# Altium schematic sheet Motor.SchDoc
size A3; SheetNumber: 5; SheetTotal: 6
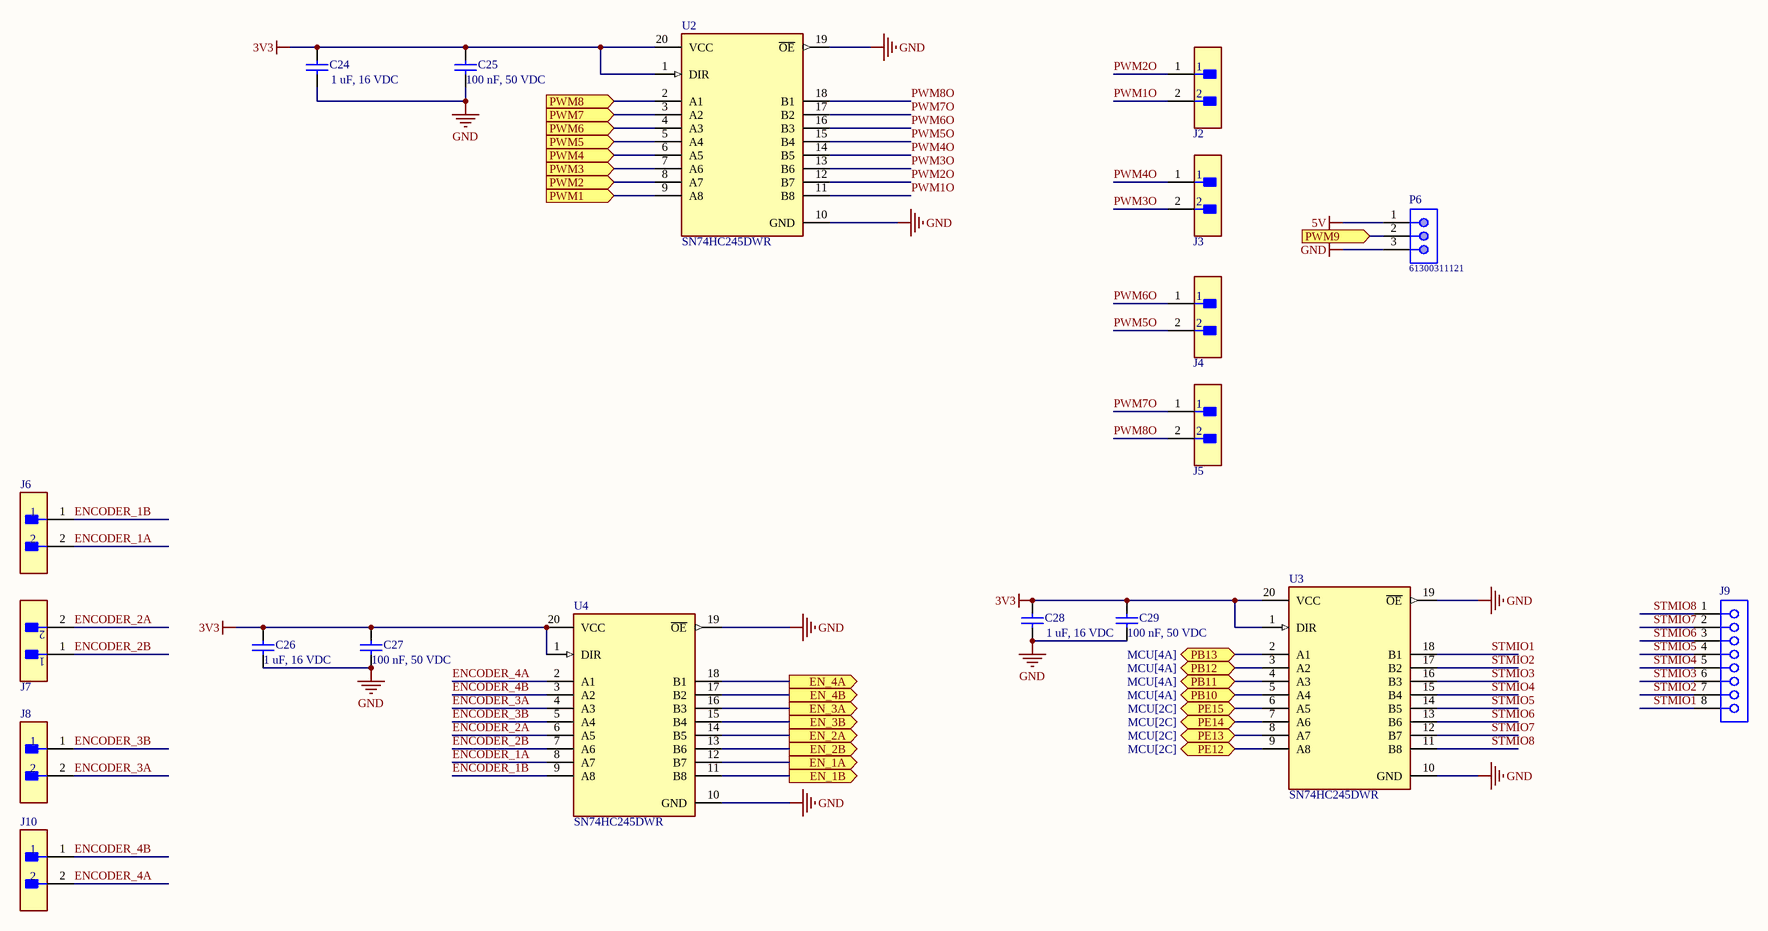
[diagram p0: Motor.SchDoc]

## Parts
C24  1 uF, 16 VDC  [CAP_0603]
C25  100 nF, 50 VDC  [CAP_0603]
C26  1 uF, 16 VDC  [CAP_0603]
C27  100 nF, 50 VDC  [CAP_0603]
C28  1 uF, 16 VDC  [CAP_0603]
C29  100 nF, 50 VDC  [CAP_0603]
J2  B2B-XH-A(LF)(SN)  [FP-B2B-XH-A_LF_SN-MFG]  (value not drawn)
J3  B2B-XH-A(LF)(SN)  [FP-B2B-XH-A_LF_SN-MFG]  (value not drawn)
J4  B2B-XH-A(LF)(SN)  [FP-B2B-XH-A_LF_SN-MFG]  (value not drawn)
J5  B2B-XH-A(LF)(SN)  [FP-B2B-XH-A_LF_SN-MFG]  (value not drawn)
J6  B2B-XH-A(LF)(SN)  [FP-B2B-XH-A_LF_SN-MFG]  (value not drawn)
J7  B2B-XH-A(LF)(SN)  [FP-B2B-XH-A_LF_SN-MFG]  (value not drawn)
J8  B2B-XH-A(LF)(SN)  [FP-B2B-XH-A_LF_SN-MFG]  (value not drawn)
J9  61300811821  [61300811821]  (value not drawn)
J10  B2B-XH-A(LF)(SN)  [FP-B2B-XH-A_LF_SN-MFG]  (value not drawn)
P6  61300311121  [61300311121]
U2  SN74HC245DWR  [FP-DW0020A-IPC_A]
U3  SN74HC245DWR  [FP-DW0020A-IPC_A]
U4  SN74HC245DWR  [FP-DW0020A-IPC_A]

## Ports
EN_1A (out, see MCU[2C]), EN_1B (out, see MCU[2C]), EN_2A (out, see MCU[2A]), EN_2B (out, see MCU[2A]), EN_3A (out, see MCU[2A]), EN_3B (out, see MCU[4A]), EN_4A (out, see MCU[2A]), EN_4B (out, see MCU[2A]), PB10 (bidir, see MCU[4A]), PB11 (bidir, see MCU[4A]), PB12 (bidir, see MCU[4A]), PB13 (bidir, see MCU[4A]), PE12 (bidir, see MCU[2C]), PE13 (bidir, see MCU[2C]), PE14 (bidir, see MCU[2C]), PE15 (bidir, see MCU[2C]), PWM1 (in, see MCU[4B]), PWM2 (in, see MCU[4B]), PWM3 (in, see MCU[4B]), PWM4 (in, see MCU[4B]), PWM5 (in, see MCU[2B]), PWM6 (in, see MCU[2B]), PWM7 (in, see MCU[2B]), PWM8 (in, see MCU[2B]), PWM9 (in, see MCU[4A])

## Nets
3V3: C24.2 C25.2 C26.2 C27.2 C28.2 C29.2 U2.1(DIR) U2.20(VCC) U3.1(DIR) U3.20(VCC) U4.1(DIR) U4.20(VCC)
5V: P6.1
GND: C24.1 C25.1 C26.1 C27.1 C28.1 C29.1 P6.3 U2.10(GND) U2.19(~{OE}) U3.10(GND) U3.19(~{OE}) U4.10(GND) U4.19(~{OE})
EN_1A: U4.12(B7) ; port EN_1A
EN_1B: U4.11(B8) ; port EN_1B
EN_2A: U4.14(B5) ; port EN_2A
EN_2B: U4.13(B6) ; port EN_2B
EN_3A: U4.16(B3) ; port EN_3A
EN_3B: U4.15(B4) ; port EN_3B
EN_4A: U4.18(B1) ; port EN_4A
EN_4B: U4.17(B2) ; port EN_4B
ENCODER_1A: J6.2 U4.8(A7)
ENCODER_1B: J6.1 U4.9(A8)
ENCODER_2A: J7.2 U4.6(A5)
ENCODER_2B: J7.1 U4.7(A6)
ENCODER_3A: J8.2 U4.4(A3)
ENCODER_3B: J8.1 U4.5(A4)
ENCODER_4A: J10.2 U4.2(A1)
ENCODER_4B: J10.1 U4.3(A2)
PB10: U3.5(A4) ; port PB10
PB11: U3.4(A3) ; port PB11
PB12: U3.3(A2) ; port PB12
PB13: U3.2(A1) ; port PB13
PE12: U3.9(A8) ; port PE12
PE13: U3.8(A7) ; port PE13
PE14: U3.7(A6) ; port PE14
PE15: U3.6(A5) ; port PE15
PWM1: U2.9(A8) ; port PWM1
PWM1O: J2.2 U2.11(B8)
PWM2: U2.8(A7) ; port PWM2
PWM2O: J2.1 U2.12(B7)
PWM3: U2.7(A6) ; port PWM3
PWM3O: J3.2 U2.13(B6)
PWM4: U2.6(A5) ; port PWM4
PWM4O: J3.1 U2.14(B5)
PWM5: U2.5(A4) ; port PWM5
PWM5O: J4.2 U2.15(B4)
PWM6: U2.4(A3) ; port PWM6
PWM6O: J4.1 U2.16(B3)
PWM7: U2.3(A2) ; port PWM7
PWM7O: J5.1 U2.17(B2)
PWM8: U2.2(A1) ; port PWM8
PWM8O: J5.2 U2.18(B1)
PWM9: P6.2 ; port PWM9
STMIO1: J9.8 U3.18(B1)
STMIO2: J9.7 U3.17(B2)
STMIO3: J9.6 U3.16(B3)
STMIO4: J9.5 U3.15(B4)
STMIO5: J9.4 U3.14(B5)
STMIO6: J9.3 U3.13(B6)
STMIO7: J9.2 U3.12(B7)
STMIO8: J9.1 U3.11(B8)

## Library data of the parts
C24 C26 C28 = 0106031051016: CAP, size 0603, 1 uF, 16 VDC; Manufacture Name: Samsung Electro-Mechanics; Manufacture SN: CL10B105KO8NNWC; Capacitance: 1 uF; Tolerance: +/-10%; Voltage Rating DC: 16 VDC; ComponentLink2Description: Datasheet; ComponentLink2URL: https://www.mouser.vn/datasheet/2/585/Samsung_MLCC_1837944-1929650.pdf; Operating Temperature: -55 to +125degC; Packaging: Tape and Reel; Mounting Technology: SMT; Size: 0603; Supplier 1 Name: Mouser; Supplier 1 SN: 187-CL10B105KO8NNWC; Supplier 1 URL: https://www.mouser.vn/ProductDetail/Samsung-Electro-Mechanics/CL10B105KO8NNWC?qs=81r%252BiQLm7BT%252BXtc72qn1ug%3D%3D&utm_source=mouser-refine-download&utm_medium=file&utm_campaign=CL10B105KO8NNWC&utm_content=Samsung-Electro-Mechanics; Supplier 2 Name: Digi-Key; Supplier 2 SN: 1276-CL10B105KO8NNWCTR-ND; Supplier 2 URL: https://www.digikey.com/en/products/detail/samsung-electro-mechanics/cl10b105ko8nnwc/16572783; Supplier 3 Name: thegioiic; Supplier 3 SN: N/A; Supplier 3 URL: https://www.thegioiic.com/tu-gom-0603-1uf-16v; Value: 1 uF, 16 VDC
C25 C27 C29 = 0106031041050: CAP, size 0603, 100 nF, 50 VDC; Manufacture Name: TDK; Manufacture SN: CGA3E3X8R1H104K080AE; Capacitance: 100 nF; Tolerance: +/-10%; Voltage Rating DC: 50 VDC; ComponentLink2Description: Datasheet; ComponentLink2URL: https://product.tdk.com/system/files/dam/doc/product/capacitor/ceramic/mlcc/catalog/mlcc_automotive_soft_en.pdf?ref_disty=mouser; Operating Temperature: -55 to +125degC; Packaging: Tape and Reel; Mounting Technology: SMT; Size: 0603; Supplier 1 Name: Mouser; Supplier 1 SN: 810-CGA3E3X8R1H104KA; Supplier 1 URL: https://www.mouser.com/ProductDetail/TDK/CGA3E3X8R1H104K080AE?qs=nQSIdc08i%252Bd8g3IRRgU2bw%3D%3D&utm_source=mouser-refine-download&utm_medium=file&utm_campaign=CGA3E3X8R1H104K080AE&utm_content=TDK; Supplier 2 Name: Digi-Key; Supplier 2 SN: 445-173697-2-ND; Supplier 2 URL: https://www.digikey.com/en/products/detail/tdk-corporation/cga3e3x8r1h104k080ae/5809262; Supplier 3 Name: thegioiic; Supplier 3 SN: N/A; Supplier 3 URL: N/A; Value: 100 nF, 50 VDC
J2-J8 J10 = CMP-2000-05888-3: CONN HEADER VERT 2POS 2.5MM; Current Rating: 3A; Voltage Rating: 250V; Number of Contacts: 2; Contact Resistance: 20mR; Wire/Cable Gauge: 22AWG; Insulation Resistance: 1GR; Connector Type: Male Pin; Packaging: Bulk; Contact Material: Brass; Lead Free: Lead Free; Orientation: Straight; Contact Plating: Tin; Max Current Rating: 3A; Termination: Solder; Fastening Type: Detent; Depth: 5.75mm; Housing Material: Polyamide; REACH SVHC: No SVHC; Series: XH; Voltage Rating (AC): 250V; Number of Positions: 2; Color: Natural; Contact Type: Male Pin; Max Voltage Rating (DC): 250V; Pitch: 2.5mm; Lead Pitch: 2.5mm; Mount: Through Hole; Max Operating Temperature: 85°C; Length: 7.4mm; Max Voltage Rating (AC): 250V; Min Operating Temperature: -25°C; Number of Rows: 1; Housing Color: White
J9 = 61300811821: WR-PHD Socket Header, THT, pitch 2.54mm, Single Row, Vertical, 8p; Manufacturer: Wurth Elektronik; Pin Number: 8; Rated Current: 3A; Working Voltage: 250VAC; Withstanding Voltage: 500VAC; Contact Resistance: 20mOhm; ComponentLink1Description: Manufacturer; ComponentLink1URL: http://www.we-online.de; ComponentLink2Description: Datasheet; ComponentLink2URL: https://www.we-online.com/catalog/datasheet/61300811821.pdf; Manufacturer Part Number: 61300811821; Published Date: May 2020; Pitch: 2.54mm; Operating Temperature: -40 to +125degC; Mounting Technology: THT; Packaging: Tray; Gender: Socket Header; Row Number: Single; Orientation: Vertical; ComponentLink3Description: Global Supply; ComponentLink3URL: https://www.we-online.com/en/components/products/PHD_2_54_SOCKET_HEADER_6130XX11821?sq=61300811821#61300811821; ComponentLink4Description: Global Supply; ComponentLink4URL: https://www.mouser.vn/ProductDetail/Wurth-Elektronik/61300811821?qs=ulEaXIWI0c%252BOxrSqc7jVmQ%3D%3D; ComponentLink5Description: Local Supply; ComponentLink5URL: https://www.thegioiic.com/hang-rao-cai-don-2-54mm-8-chan-1-hang-cao-11-8mm-xuyen-lo; Supplier 1 Name: Mouser; Supplier 1 SN: 710-61300811821; Supplier 1 URL: https://www.mouser.vn/ProductDetail/Wurth-Elektronik/61300811821?qs=ulEaXIWI0c%252BOxrSqc7jVmQ%3D%3D; Supplier 2 Name: Digi-Key; Supplier 2 SN: N/A; Supplier 2 URL: N/A; Supplier 3 Name: thegioiic; Supplier 3 SN: N/A; Supplier 3 URL: https://www.thegioiic.com/hang-rao-cai-don-2-54mm-8-chan-1-hang-cao-11-8mm-xuyen-lo
P6 = 61300311121: WR-PHD Pin Header, THT, pitch 2.54mm, Single Row, Vertical, 3p; Manufacturer: Wurth Elektronik; Pin Number: 3; Rated Current: 3A; Working Voltage: 250VAC; Withstanding Voltage: 500VAC; Contact Resistance: 20mOhm; Supply Name 1: Mouser; ComponentLink1Description: Manufacturer; ComponentLink1URL: http://www.we-online.de; ComponentLink2Description: Datasheet; ComponentLink2URL: https://www.we-online.com/catalog/datasheet/61300311121.pdf; Manufacturer Part Number: 61300311121; Published Date: May 2020; Pitch: 2.54mm; Operating Temperature: -40 to +105degC; Mounting Technology: THT; Packaging: Bag; Gender: Pin Header; Row Number: Single; Orientation: Vertical; ComponentLink3Description: Global Supply; ComponentLink3URL: https://www.mouser.vn/ProductDetail/Wurth-Elektronik/61300311121?qs=PhR8RmCirEYxRWFJzNKsUw%3D%3D; Supplier 1 Name: Mouser; Supplier 1 SN: 710-61300311121; Supplier 1 URL: https://www.mouser.vn/ProductDetail/Wurth-Elektronik/61300311121?qs=PhR8RmCirEYxRWFJzNKsUw%3D%3D; Supplier 2 Name: Digi-Key; Supplier 2 SN: N/A; Supplier 2 URL: N/A; Supplier 3 Name: thegioiic; Supplier 3 SN: N/A; Supplier 3 URL: N/A
U2-U4 = CMP-1620-00193-3: IC TRANSCVR NON-INVERT 6V 20SOIC; Logic Function: Transceiver; Number of Circuits: 8; High Level Output Current: -7.8mA; Min Supply Voltage: 2V; Direction: Bidirectional; Propagation Delay: 335ns; Number of Elements: 1; Operating Supply Voltage: 5V; Polarity: Non-Inverting; Quiescent Current: 8uA; Low Level Output Current: 7.8mA; Number of Channels: 8; Width: 7.52mm; Length: 12.8mm; Case/Package: SOIC; Lead Free: Lead Free; Max Supply Voltage: 6V; Max Operating Temperature: 85°C; Mount: Surface Mount; Weight: 0.017662oz; Height: 2.35mm; Contact Plating: Gold; Package Quantity: 1; RoHS Compliant: Yes; Min Operating Temperature: -40°C; Packaging: Tape and Reel; Number of Bits per Element: 8; Number of Outputs: 8; Number of Bits: 8; Number of Pins: 20; REACH SVHC: No SVHC; Turn-On Delay Time: 335ns; Radiation Hardening: No